# EAGLE design Схема платы (2) (EAGLE 9.4.2)
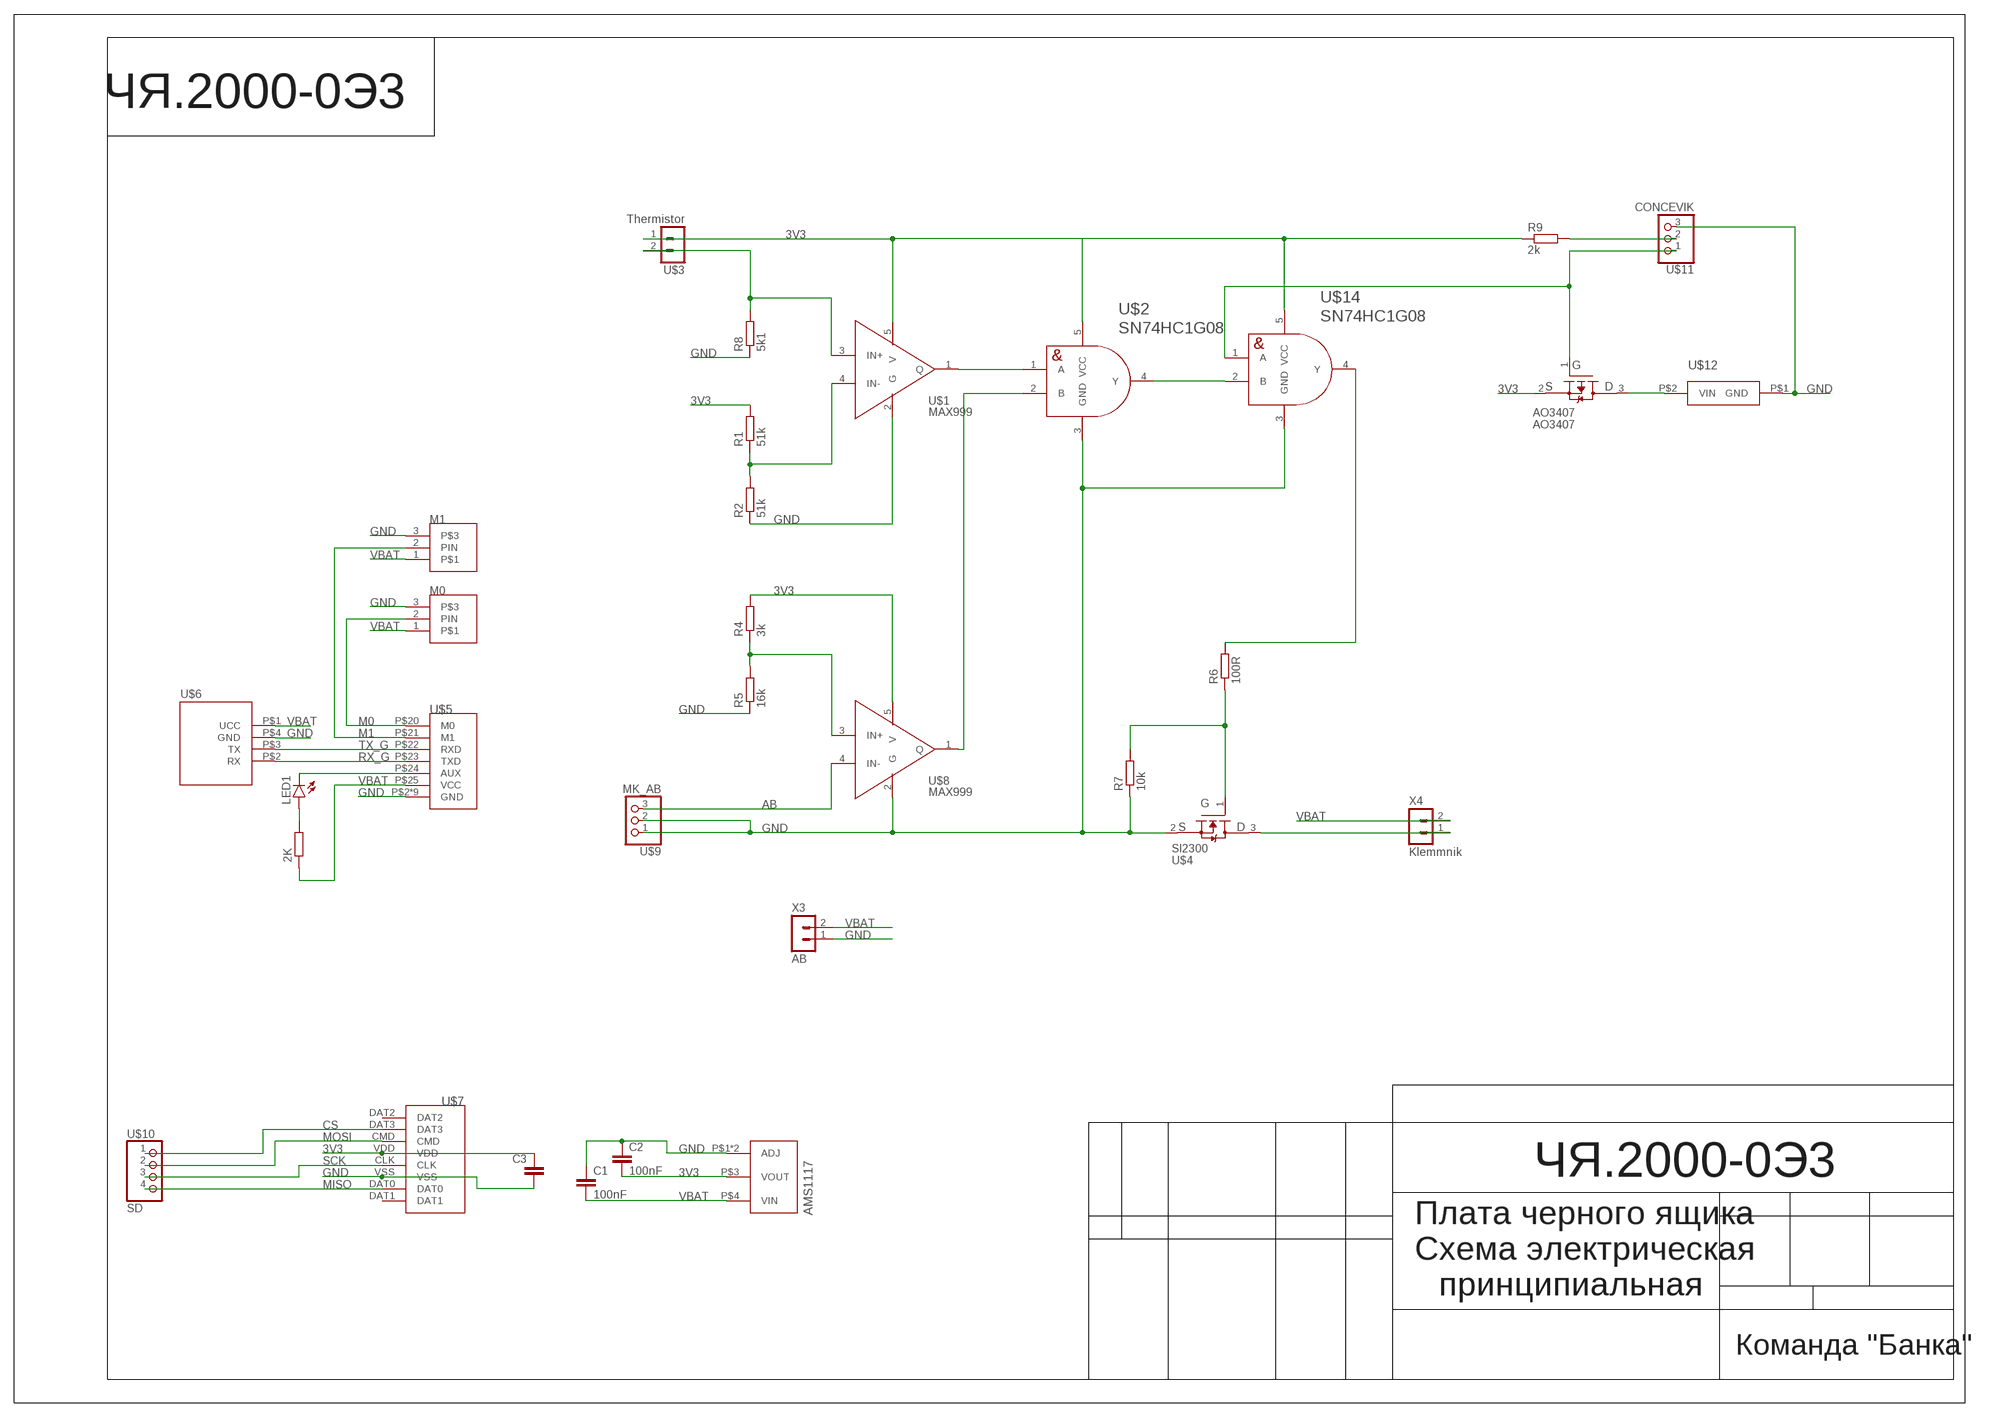
[diagram p0: schematic, sheet 1]

## Parts
2K  R-EU_R0603  [R0603]
AMS1117  AMS1117  [SOT223]
AO3407  AO3407  [SOT23-3]
C1  100nF  C-EUC0603  [C0603]
C2  100nF  C-EUC0603  [C0603]
C3  C-EUC0603  [C0603]
LED1  LEDCHIP-LED0603  [CHIP-LED0603]
M0  CONNECT_3  [CONNECT_3]
M1  CONNECT_3  [CONNECT_3]
R1  51k  R-EU_R0603  [R0603]
R2  51k  R-EU_R0603  [R0603]
R4  3k  R-EU_R0603  [R0603]
R5  16k  R-EU_R0603  [R0603]
R6  100R  R-EU_R0603  [R0603]
R7  10k  R-EU_R0603  [R0603]
R8  5k1  R-EU_R0603  [R0603]
R9  2k  R-EU_R0603  [R0603]
U$1  MAX999  [SOT23-5]
U$2  SN74HC1G08  [SOT23-5]
U$3  Thermistor  MOLEX-2-1.25  [53047-02]
U$4  SI2300  [SOT23-3]
U$5  E220-400T22S  [E220-400T22S]
U$6  GPS-NEO7M  [GPS-NEO7M]
U$7  SD  [SD]
U$8  MAX999  [SOT23-5]
U$9  MK_AB  MOLEX-3-1.25  [53047-03]
U$10  SD  MOLEX-4-1.25  [53047-04]
U$11  CONCEVIK  MOLEX-3-1.25  [53047-03]
U$12  BUZZERS8R6  [BUZZER-S8R12]
U$14  SN74HC1G08  [SOT23-5]
X3  AB  JST-2-2.5  [JST-2-2.5]
X4  Klemmnik  JST-2-2.5  [JST-2-2.5]

## Nets
3V3: AMS1117.P$3(VOUT) AO3407.2(PS) C2.2 C3.1 R1.2 R4.2 R9.2 U$1.5(V) U$2.5(VCC) U$3.1 U$7.VDD U$8.5(V) U$14.5(VCC)
AB: U$8.4(IN-) U$9.3
CS: U$7.DAT3 U$10.1
GND: AMS1117.P$1(ADJ) AMS1117.P$2(ADJ) C1.1 C2.1 C3.2 M0.3 M1.3 R2.1 R5.1 R7.1 R8.1 U$1.2(G) U$2.3(GND) U$4.2(NS) U$5.P$2(GND) U$5.P$8(GND) U$5.P$11(GND) U$5.P$13(GND) U$5.P$14(GND) U$5.P$15(GND) U$5.P$16(GND) U$5.P$19(GND) U$5.P$26(GND) U$6.P$4(GND) U$7.VSS U$8.2(G) U$9.1 U$9.2 U$11.3 U$12.P$1(GND) U$14.3(GND) X3.1
M0: M0.2(PIN) U$5.P$20(M0)
M1: M1.2(PIN) U$5.P$21(M1)
MISO: U$7.DAT0 U$10.4
MOSI: U$7.CMD U$10.2
N$1: R8.2 U$1.3(IN+) U$3.2
N$2: R9.1 U$11.2
N$3: R4.1 R5.2 U$8.3(IN+)
N$4: 2K.2 LED1.A
N$5: LED1.C U$5.P$24(AUX)
N$8: R1.1 R2.2 U$1.4(IN-)
N$9: U$1.1(Q) U$2.1(A)
N$10: U$2.2(B) U$8.1(Q)
N$11: U$4.3(ND) X4.1
N$12: U$2.4(Y) U$14.2(B)
N$13: R6.1 R7.2 U$4.1(NG)
N$14: AO3407.3(PD) U$12.P$2(VIN)
N$15: AO3407.1(PG) U$11.1 U$14.1(A)
N$17: R6.2 U$14.4(Y)
RX_G: U$5.P$23(TXD) U$6.P$2(RX)
SCK: U$7.CLK U$10.3
TX_G: U$5.P$22(RXD) U$6.P$3(TX)
VBAT: 2K.1 AMS1117.P$4(VIN) C1.2 M0.1 M1.1 U$5.P$25(VCC) U$6.P$1(UCC) X3.2 X4.2
Unconnected: U$7.DAT1 U$7.DAT2

## Notes on the sheet
- ЧЯ.2000-0Э3
- ЧЯ.2000-0Э3
- Плата черного ящика
- Схема электрическая
- принципиальная
- Команда "Банка"

## Library data of the parts
2K R1 R2 R4-R9 = rcl:R-EU_: RESISTOR, European symbol; SPICEPREFIX: R
AMS1117 = CanCubeSat:AMS1117
AO3407 = Banka-2026:AO3407
C1-C3 = rcl:C-EU: CAPACITOR, European symbol; SPICEPREFIX: C
LED1 = led:LED: LED OSRAM: - CHIPLED LG R971, LG N971, LY N971, LG Q971, LY Q971, LO R971, LY R971 LH N974, LH R974 LS Q976, LO Q976, LY Q976 LO Q996 - Hyper CHIPLED LW Q18S LB Q993, LB Q99A, LB R99A - SideLED LS A670, LO A670, LY A670, LG A670, LP A670 LB A673, LV A673, LT A673, LW A673 LH A674 LY A675 LS A676, LA A676, LO A676, LY A676, LW A676 LS A679, LY A679, LG A679 - Hyper Micro SIDELED® LS Y876, LA Y876, LO Y876, LY Y876 LT Y87S - SmartLED LW L88C, LW L88S LB L89C, LB L89S, LG L890 LS L89K, LO L89K, LY L89K LS L896, LA L896, LO L896, LY L896 - TOPLED LS T670, LO T670, LY T670, LG T670, LP T670 LSG T670, LSP T670, LSY T670, LOP T670, LYG T670 LG T671, LOG T671, LSG T671 LB T673, LV T673, LT T673, LW T673 LH T674 LS T676, LA T676, LO T676, LY T676, LB T676, LH T676, LSB T676, LW T676 LB T67C, LV T67C, LT T67C, LS T67K, LO T67K, LY T67K, LW E67C LS E67B, LA E67B, LO E67B, LY E67B, LB E67C, LV E67C, LT E67C LW T67C LS T679, LY T679, LG T679 LS T770, LO T770, LY T770, LG T770, LP T770 LB T773, LV T773, LT T773, LW T773 LH T774 LS E675, LA E675, LY E675, LS T675 LS T776, LA T776, LO T776, LY T776, LB T776 LHGB T686 LT T68C, LB T68C - Hyper Mini TOPLED® LB M676 - Mini TOPLED Santana® LG M470 LS M47K, LO M47K, LY M47K Source: http://www.osram.convergy.de LUXEON: - LUMILED® LXK2-PW12-R00, LXK2-PW12-S00, LXK2-PW14-U00, LXK2-PW14-V00 LXK2-PM12-R00, LXK2-PM12-S00, LXK2-PM14-U00 LXK2-PE12-Q00, LXK2-PE12-R00, LXK2-PE12-S00, LXK2-PE14-T00, LXK2-PE14-U00 LXK2-PB12-K00, LXK2-PB12-L00, LXK2-PB12-M00, LXK2-PB14-N00, LXK2-PB14-P00, LXK2-PB14-Q00 LXK2-PR12-L00, LXK2-PR12-M00, LXK2-PR14-Q00, LXK2-PR14-R00 LXK2-PD12-Q00, LXK2-PD12-R00, LXK2-PD12-S00 LXK2-PH12-R00, LXK2-PH12-S00 LXK2-PL12-P00, LXK2-PL12-Q00, LXK2-PL12-R00 Source: www.luxeon.com KINGBRIGHT: KA-3528ASYC Source: www.kingbright.com
M0 M1 = UNKNOWN-2024:CONNECT_3
U$1 U$8 = Banka-2026:MAX999
U$2 U$14 = Banka-2026:SN74HC1G08
U$3 = UNKNOWN-2024:MOLEX-2-1.25
U$4 = Banka-2026:SI2300
U$5 = UNKNOWN-2024:E220-400T22S
U$6 = UNKNOWN-2024:GPS-NEO7M
U$7 = UNKNOWN-2024:SD
U$9 U$11 = UNKNOWN-2024:MOLEX-3-1.25
U$10 = UNKNOWN-2024:MOLEX-4-1.25
U$12 = Banka-2026:BUZZER
X3 X4 = UNKNOWN-2024:JST-2-2.5: JST PH series header 2.00mm pitch disconnectable crimp style connectors, vertical (side entry type), 2 pins

## Board
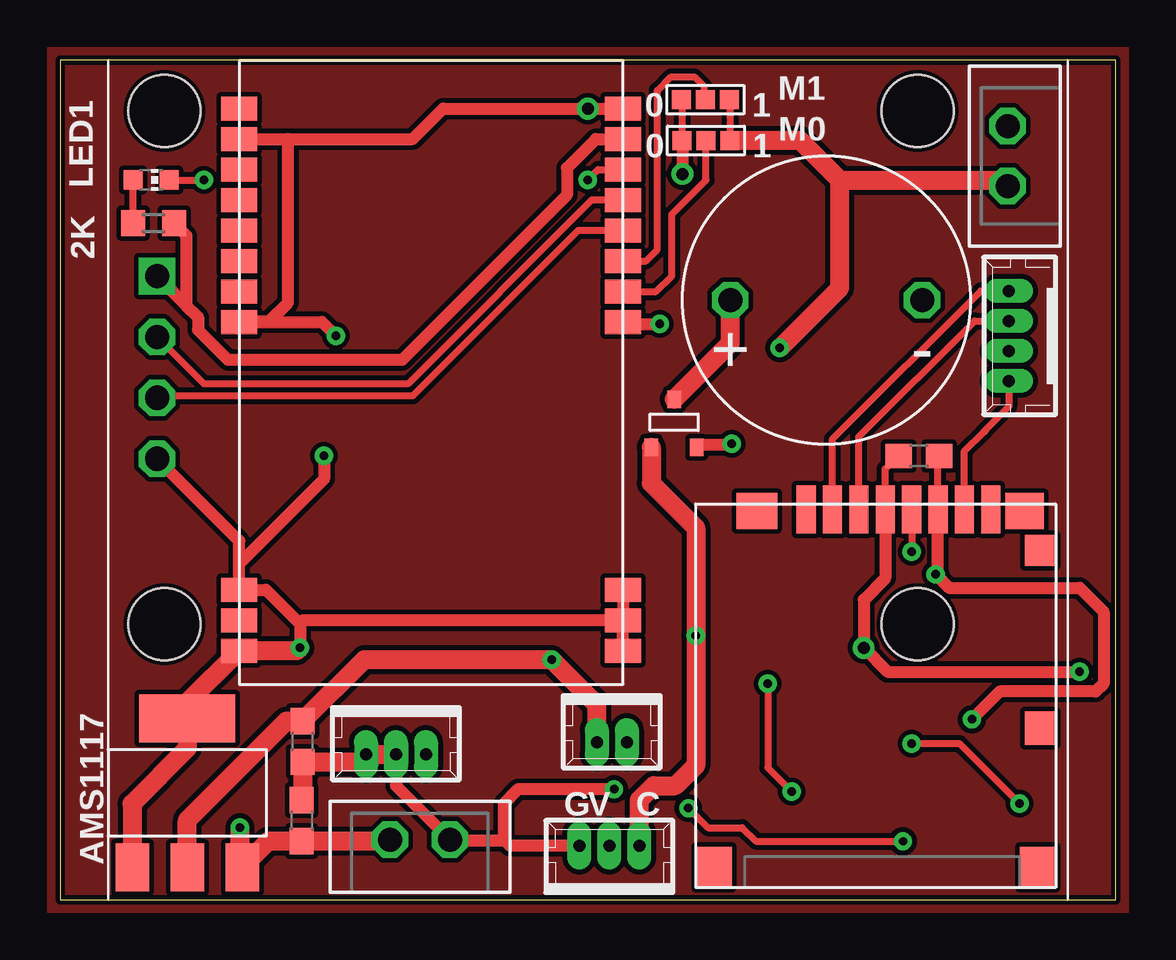
[diagram p1: board, top side]
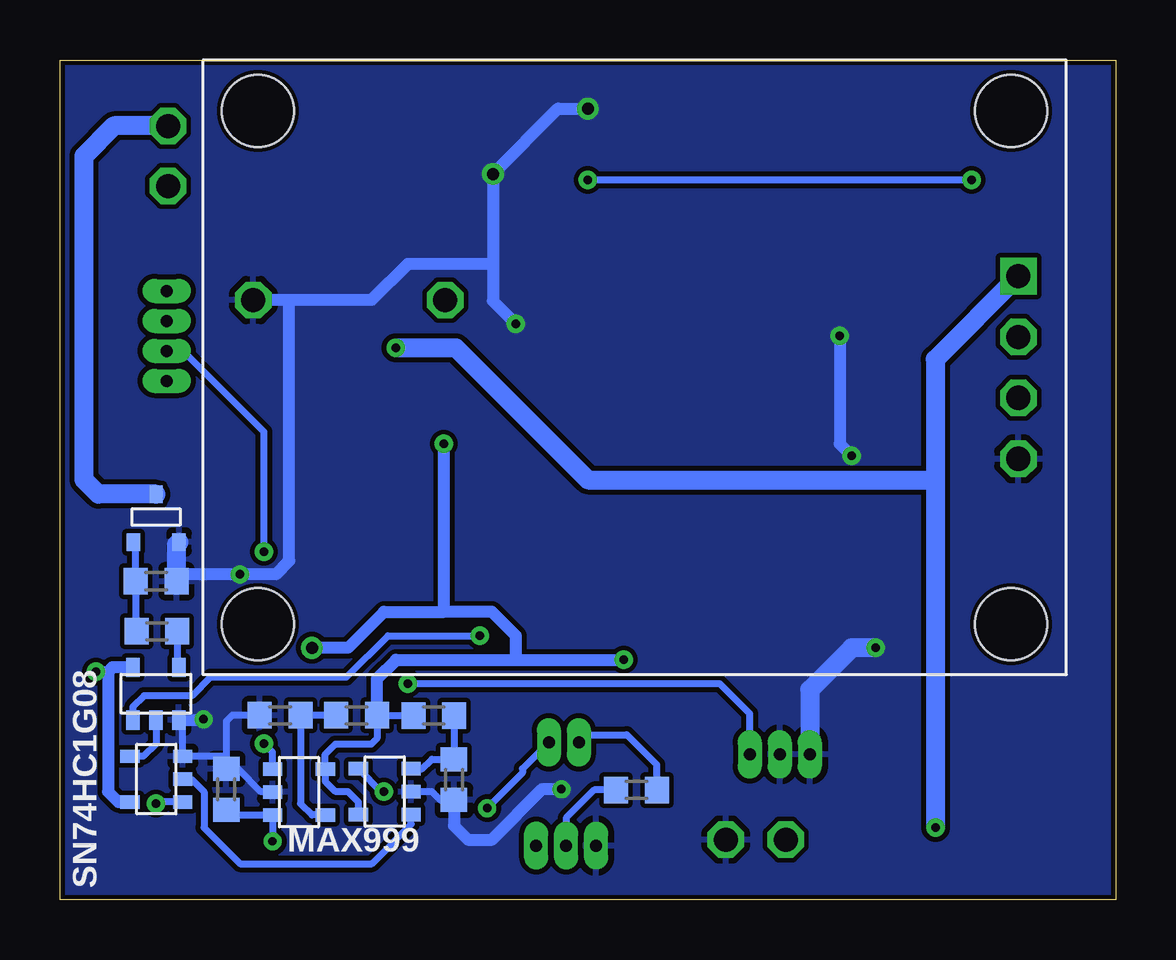
[diagram p2: board, bottom side, seen from below]

Size 44 x 35 mm. Coordinates in mm from the lower left corner, seen from the top.
Outline: 0,0 44,0 44,35 0,35 0,0
Copper layers (1*16): Top 0.035mm / dielectric 1.5mm / Bottom 0.035mm
Design rules "default *": minimum track width 0.2mm, minimum drill 0.35mm, track to track 0.2mm, track to pad 0.2mm, pad to pad 0.2mm, via to via 0.2mm, smd to smd 0.2mm, copper to edge 0.2mm, drill to drill 6mil, minimum pad ring 10mil, minimum via ring 8mil, stop-mask expansion 4mil, vias tented up to drill 0mil, thermal gap 10mil

### Footprints (pad centres in the part's own frame; a part is rotated, then mirrored left to right if it is on the bottom)
R0603 = smd 1 x 1.1: 1 -0.85,0; 2 0.85,0
SOT223 = smd 4 x 2: P$1 0,3.1 | smd 1.4 x 2: P$2 -2.29,-3.1; P$3 0,-3.1; P$4 2.29,-3.1
SOT23-3 = smd 0.56 x 0.73: 1 -0.95,-1; 2 0.95,-1; 3 0,1
C0603 = smd 1.1 x 1: 1 -0.85,0; 2 0.85,0
CHIP-LED0603 = smd 0.8 x 0.8: A 0,-0.75; C 0,0.75
CONNECT_3 = smd 0.8 x 0.8: 1 1,0; 2 0,0; 3 -1,0
SOT23-5 = smd 0.56 x 0.8: 1 -0.95,-1.1; 2 0,-1.1; 3 0.95,-1.1; 4 0.95,1.1; 5 -0.95,1.1
53047-02 = drill 0.5 pad 0.698 long: 1 0.625,0.45; 2 -0.625,0.45
E220-400T22S = smd 1.5 x 1: P$1 -8,11; P$2 -8,9.73; P$3 -8,8.46; P$4 -8,7.19; P$5 -8,5.92; P$6 -8,4.65; P$7 -8,3.38; P$8 -8,2.11; P$11 -8,-9.06; P$12 -8,-10.33; P$13 -8,-11.6; P$14 8,-11.6; P$15 8,-10.33; P$16 8,-9.06; P$19 8,2.11; P$20 8,3.38; P$21 8,4.65; P$22 8,5.92; P$23 8,7.19; P$24 8,8.46; P$25 8,9.73; P$26 8,11
GPS-NEO7M = drill 1.016 square: P$1 -3.81,16 | drill 1.016 octagon: P$2 -1.27,16; P$3 1.27,16; P$4 3.81,16 | hole 3: -10.7,15.7; 10.7,15.7; 10.7,-15.7; -10.7,-15.7
SD = smd 0.8 x 2: CLK 6,-15.77; CMD 8.2,-15.77; DAT0 3.8,-15.77; DAT1 2.7,-15.77; DAT2 10.4,-15.77; DAT3 9.3,-15.77; VDD 7.1,-15.77; VSS 4.9,-15.77 | smd 1.5 x 1.7: P$9 0.75,-0.85; P$13 14.25,-0.85 | smd 1.6 x 1.5: P$10 1.3,-15.7 | smd 1.29 x 1.3: P$11 0.645,-14.05 | smd 1.29 x 1.4: P$12 0.645,-6.65 | smd 1.7 x 1.5: P$14 12.45,-15.7
53047-03 = drill 0.5 pad 0.698 long: 1 1.25,0.45; 2 0,0.45; 3 -1.25,0.45
53047-04 = drill 0.5 pad 0.698 long: 1 1.875,0.45; 2 0.625,0.45; 3 -0.625,0.45; 4 -1.875,0.45
BUZZER-S8R12 = drill 1 octagon: P$1 -4,0; P$2 4,0
JST-2-2.5 = drill 1 pad 1.5 octagon: 1 1.25,0; 2 -1.25,0

### Placement (x,y rotation side)
2K  3.9,28.2 180 top
AMS1117  5.31,4.45 0 top
AO3407  25.6,19.85 0 top
C1  10.08,3.29 270 top
C2  10.12,6.59 90 top
C3  35.8,18.5 0 top
LED1  3.8,30 270 top
M0  26.93,31.64 0 top
M1  26.91,33.34 0 top
R1  31.64,7.68 0 bottom
R2  34.82,7.68 0 bottom
R4  28.42,7.67 180 bottom
R5  27.58,5 90 bottom
R6  39.96,11.18 0 bottom
R7  39.99,13.27 180 bottom
R8  37.07,4.59 270 bottom
R9  19.97,4.57 0 bottom
U$1  34.04,4.48 270 bottom
U$2  39.98,5.02 90 bottom
U$3  23,7 180 top
U$4  39.99,15.9 0 bottom
U$5  15.47,21.97 0 top
U$6  20.05,22.18 270 bottom
U$7  41.5,0.5 180 top
U$8  30.46,4.5 90 bottom
U$9  14,6.5 180 top
U$10  40,23.5 90 top
U$11  22.9,1.8 0 top
U$12  31.94,24.99 180 top
U$14  40,8.58 0 bottom
X3  15,2.5 0 top
X4  39.5,31 90 top

### Tracks (layer width: path | path; a pad name or v marks a point on that pad's centre or on a via)
3V3  (via drill 0.35, 0.5)
  Top 0.3: U$7.VDD 34.4,17.95 C3.1
  Top 0.5: v42.5,9.5 34.49,9.5 v33.5,10.49 33.5,12.5 34.4,13.4 U$7.VDD | v28,19 27.95,18.95 26.65,18.95 AO3407.2
  Top 0.8: AMS1117.P$3 5.31,3.31 9.44,7.44 C2.2 12.68,10 v20.5,10 22.38,8.12 U$3.1
  Bottom 0.3: R4.2 R1.2 30.79,6.71 31.02,6.49 32.52,6.49 32.94,6.06 U$1.5 32.94,4.93 32.51,4.5 32,4.5 31.56,4.06 U$8.5 | R9.2 19.12,5.62 20.37,6.87 22.05,6.87 U$3.1
  Bottom 0.5: R1.2 30.79,9.21 30,10 25,10 | 25,10 v20.5,10 | U$14.5 41.82,9.68 42,9.5 | 42,9.5 42,4.5 41.57,4.07 U$2.5 | 25,10 25,11 26,12 28,12 | 28,12 30.49,12 32,10.49 v33.5,10.49 | v42.5,9.5 42,9.5 | 28,12 v28,19
AB  (via drill 0.35)
  Top 0.3: v30.5,4.5 29.5,5.5 v29.5,9
  Bottom 0.3: U$8.4 30.61,4.5 v30.5,4.5 | U$9.3 15.25,7.75 16.5,9 v29.5,9
CS
  Top 0.3: U$7.DAT3 32.2,19.2 38.38,25.38 U$10.1
GND  (via drill 0.35, 0.5)
  Top 0.3: M1.3 25.93,33.32 M0.3 | U$7.VSS 36.6,18.45 C3.2
  Top 0.5: U$6.P$4 7.47,14.95 7.47,14 | 7.47,14 U$5.P$11 8.59,12.91 10,11.5 | 10,11.5 v10,10.5 | 9.5,31.7 9.5,24.89 8.71,24.1 7.49,24.1 U$5.P$8 10.92,24.08 v11.5,23.5 | U$5.P$26 v22,32.97 15.97,32.97 14.7,31.7 9.5,31.7 | U$5.P$2 9.5,31.7 | M0.3 25.95,31.62 v25.95,30.25 | U$5.P$19 23.55,24 v25,24 | v23.1,4.6 19.1,4.6 18.5,4 18.5,2.5 18.55,2.45 | U$7.VSS 36.6,13.66 v36.5,13.56 37.06,13 42.5,13 43.5,12 43.5,9 43.17,8.67 39.17,8.67 v38.02,7.51 | U$5.P$14 U$5.P$15 | U$5.P$15 10.14,11.64 10,11.5 | U$5.P$16 U$5.P$15 | v11,18.5 11,17.53 7.47,14 | U$11.3 18.75,2.25 18.55,2.45 | 18.55,2.45 16.3,2.45 X3.1 14,4.75 U$9.2
  Top 0.8: AMS1117.P$2 3,1.37 3,4 5.31,6.31 AMS1117.P$1 5.31,8.21 U$5.P$13 9.87,10.37 v10,10.5 | C1.1 10.12,4.18 C2.1 12.44,5.74 U$9.1 U$9.2
  Bottom 0.3: R5.1 28.15,4.15 28.5,4.5 U$8.2 | R2.1 36.82,7.68 37.07,7.43 R8.1 | U$1.2 35.16,4.5 35.63,4.5 36.57,5.44 R8.1 | R8.1 37.07,5.94 37.1,5.97 U$2.3 38.88,7.31 39.03,7.46 U$14.3
  Bottom 0.5: 34.5,24.99 31.01,24.99 29.5,26.5 25.95,26.5 | 34.5,24.99 U$12.P$1 | v25,24 25.95,24.95 25.95,26.5 | v22,32.97 23.23,32.97 v25.95,30.25 25.95,26.5 | R5.1 27.58,3.08 27,2.5 26,2.5 23.9,4.6 v23.1,4.6 | R7.1 38.84,13.57 36.51,13.57 v36.5,13.56 35,13.56 34.44,14.12 34.44,24.93 34.5,24.99 | v38.02,7.51 38.06,7.46 39.03,7.46 | v11.5,23.5 11.5,19 v11,18.5
  Bottom 0.8: R7.1 39.14,14.8 U$4.2 | v10,10.5 11,10.5 12.75,8.75 U$9.1
  pour Bottom: -0.5,-0.5 -0.5,35.5 44.5,35.5 44.5,-0.5
GND1
  pour Top: -0.5,-0.5 -0.5,35.5 44.5,35.5 44.5,-0.5
M0
  Top 0.3: M0.2 26.93,30 25.5,28.57 25.5,26 24.85,25.35 U$5.P$20
M1
  Top 0.3: M1.2 26.86,33.39 26.86,33.88 26.45,34.3 25.48,34.3 24.9,33.73 24.9,27.1 24.42,26.62 U$5.P$21
MISO
  Top 0.3: U$7.DAT0 37.7,18.7 38.5,19.5 38.64,19.64 39.55,20.55 U$10.4
MOSI
  Top 0.3: U$7.CMD 33.3,19.3 38.12,24.12 U$10.2
N$1  (via drill 0.35)
  Top 0.3: v35.14,2.43 29,2.43 28.43,3 27,3 v26.19,3.81
  Bottom 0.3: R8.2 36.86,3.53 U$1.3 v35.14,2.43 | v26.19,3.81 24.72,5.28 24.72,5.46 U$3.2
N$2
  Bottom 0.3: R9.1 21.73,4.57 22.9,3.4 U$11.2
N$3
  Bottom 0.3: R4.1 R5.2 28.5,5.85 28.9,5.45 U$8.3
N$4
  Top 0.3: 2K.2 LED1.A
N$5  (via drill 0.35)
  Top 0.3: LED1.C v6,30 | v22,30 22.43,30.43 U$5.P$24
  Bottom 0.3: v6,30 v22,30
N$8
  Bottom 0.3: R1.1 R2.2 33.97,4 33.5,3.53 U$1.4
N$9  (via drill 0.35)
  Top 0.3: v40,4 37.5,6.5 v35.5,6.5
  Bottom 0.3: U$2.1 39.93,4.07 v40,4 | U$1.1 35.14,6.14 v35.5,6.5
N$10
  Bottom 0.3: U$2.2 38.86,5 38.5,5 38,4.5 38,3 36.5,1.5 31,1.5 29.36,3.14 U$8.1
N$11
  Bottom 0.8: U$4.3 42.4,16.9 43,17.5 43,31 41.74,32.26 X4.1
N$12
  Bottom 0.3: U$2.4 40.53,5.97 40,6.5 U$14.2
N$13
  Bottom 0.3: U$4.1 40.84,14.8 R7.2 40.84,11.21 R6.1
N$14
  Top 0.8: AO3407.3 27.94,23.19 U$12.P$2
N$15  (via drill 0.35)
  Top 0.8: AO3407.1 24.65,17.35 26.5,15.5 v26.5,11 26.5,5.59 25.66,4.75 24.75,4.75 24.15,4.15 U$11.1
  Bottom 0.3: U$14.1 40.95,8.05 40.5,8.5 38.5,8.5 37.73,9.27 32.06,9.27 30.33,11 v26.5,11
N$17
  Bottom 0.3: R6.2 39.11,9.74 U$14.4
RX_G
  Top 0.3: U$5.P$23 22.16,29.16 14.5,21.5 6,21.5 U$6.P$2
SCK  (via drill 0.35)
  Top 0.3: U$7.CLK v35.5,14.5
  Bottom 0.3: v35.5,14.5 35.5,19.5 38,22 38.18,22.18 38.88,22.88 U$10.3
TX_G
  Top 0.3: U$5.P$22 21.6,27.89 14.71,21 4.14,21 U$6.P$3
VBAT  (via drill 0.35)
  Top 0.3: M1.1 27.93,33.32 M0.1
  Top 0.5: U$6.P$1 5.27,24.77 | 5.27,24.77 5.75,24.29 5.75,23.75 7,22.5 14.27,22.5 21.14,29.36 21.14,30.5 22.34,31.7 U$5.P$25 | 2K.1 5.27,27.68 5.27,24.77
  Top 0.8: 32.5,30 30.86,31.64 M0.1 | v7.5,3 7.5,1.45 AMS1117.P$4 8.69,2.44 C1.2 13.69,2.44 X3.2 | v30,23 32.5,25.5 32.5,30 | 32.5,30 39.25,30 X4.2
  Bottom 0.8: 7.5,17.5 22,17.5 27.5,23 v30,23 | v7.5,3 7.5,17.5 | U$6.P$1 7.52,22.52 7.5,22.5 7.5,17.5

### Text on the board
tNames: G | V | C
tValues: 100nF | AO3407